# EAGLE board zx80_build039.routed (EAGLE 9.6.2), part 1 of 2
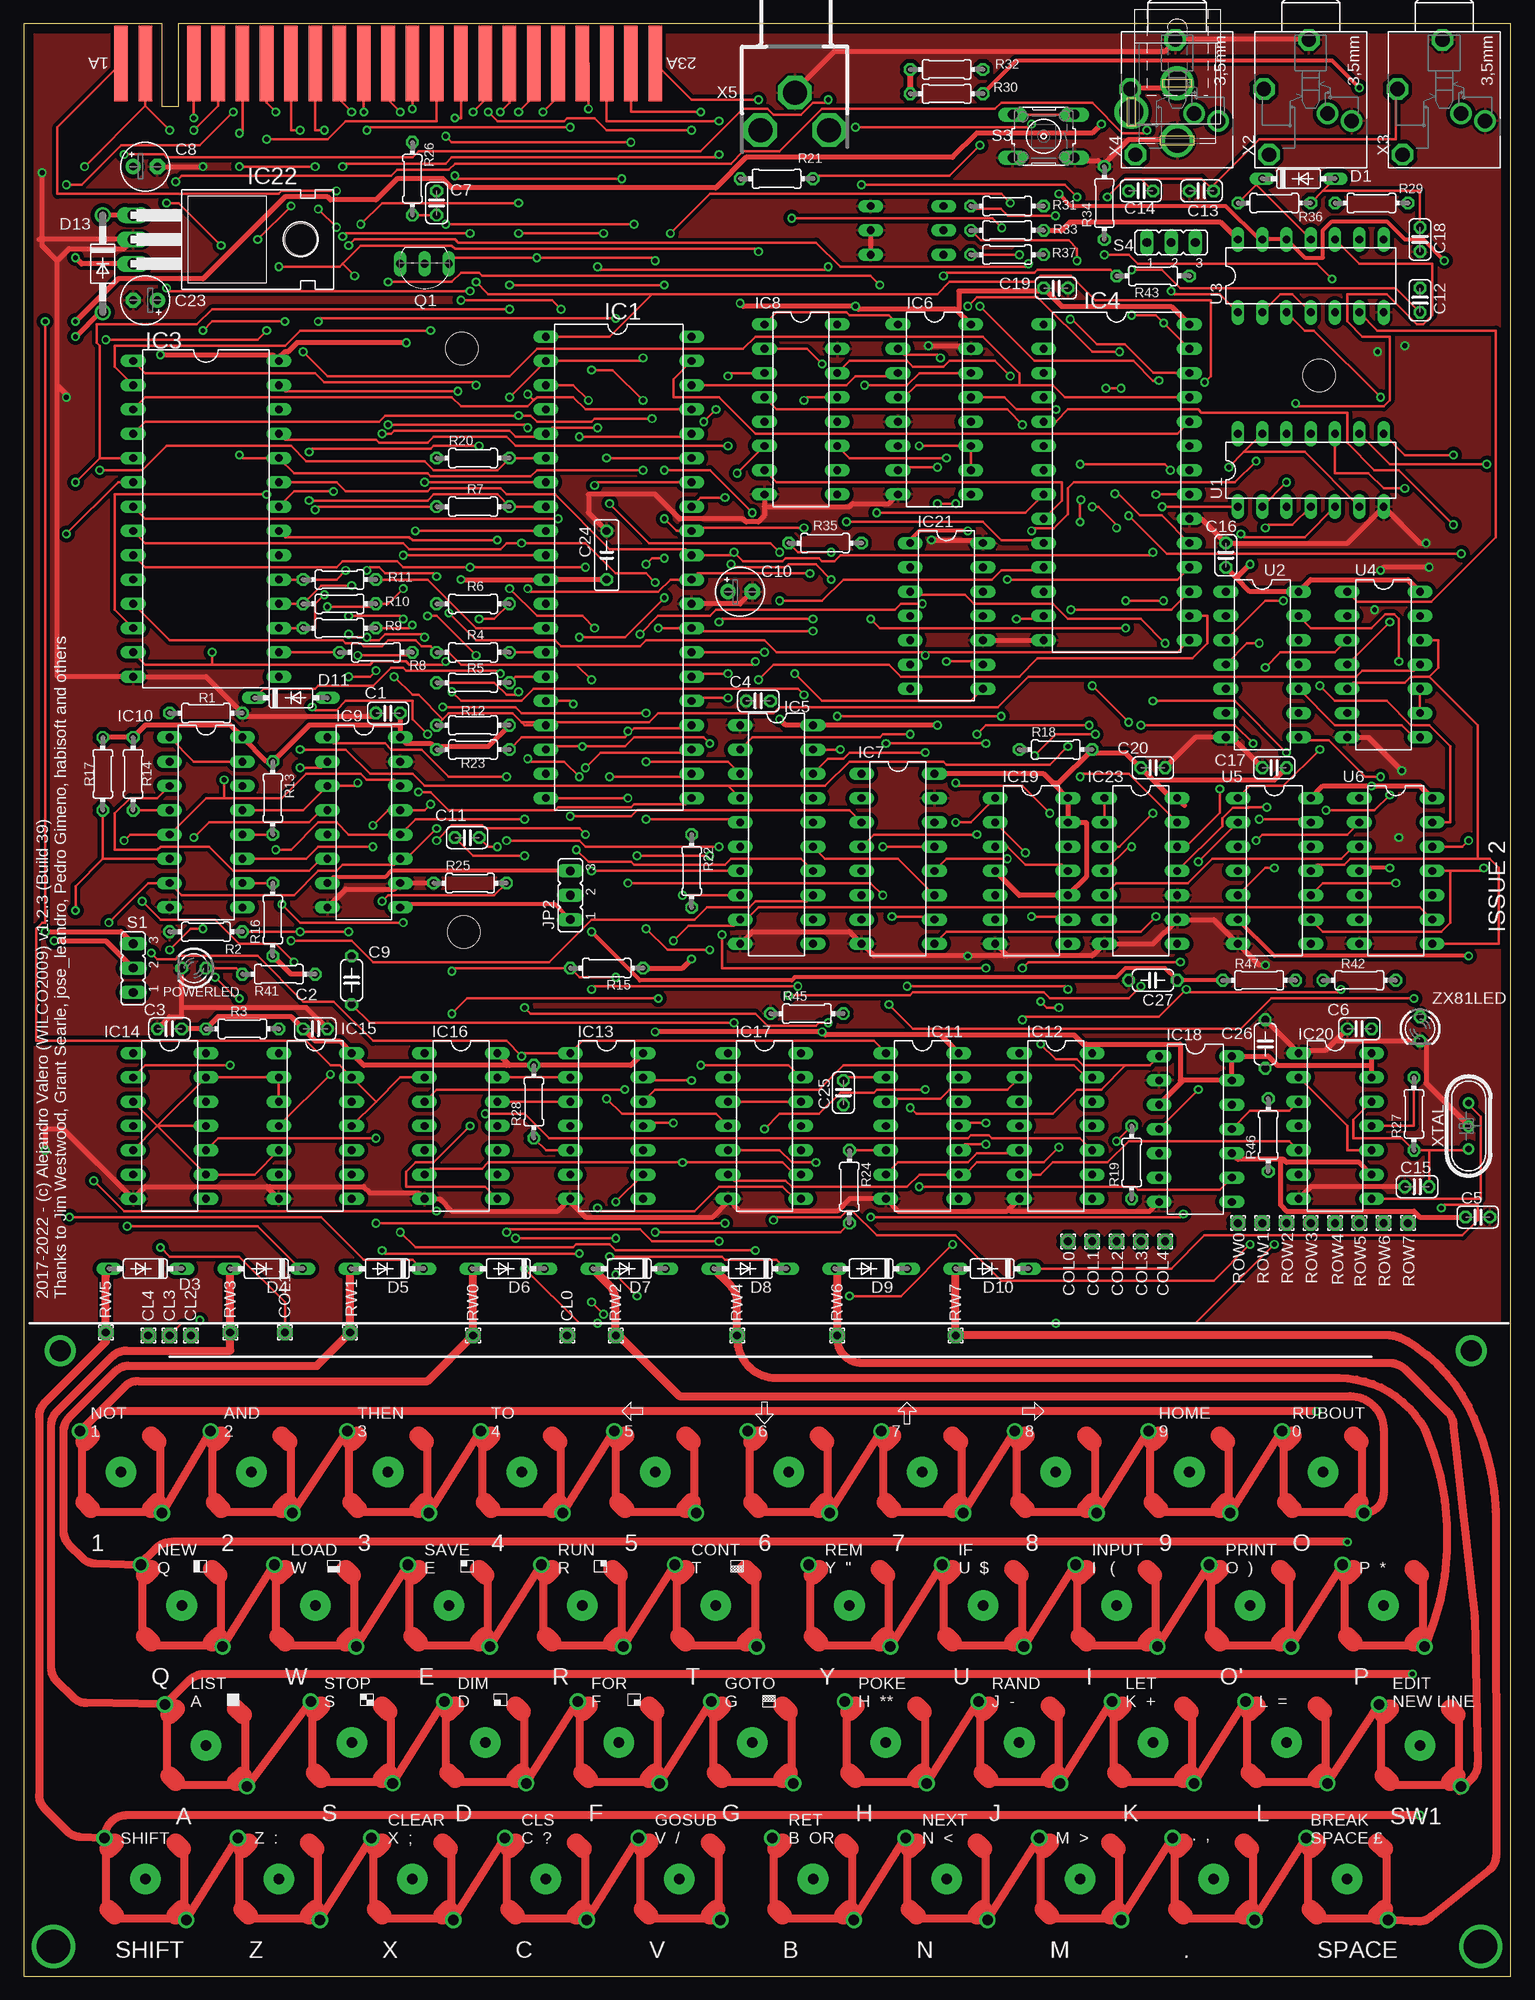
[diagram p3: board, top side]
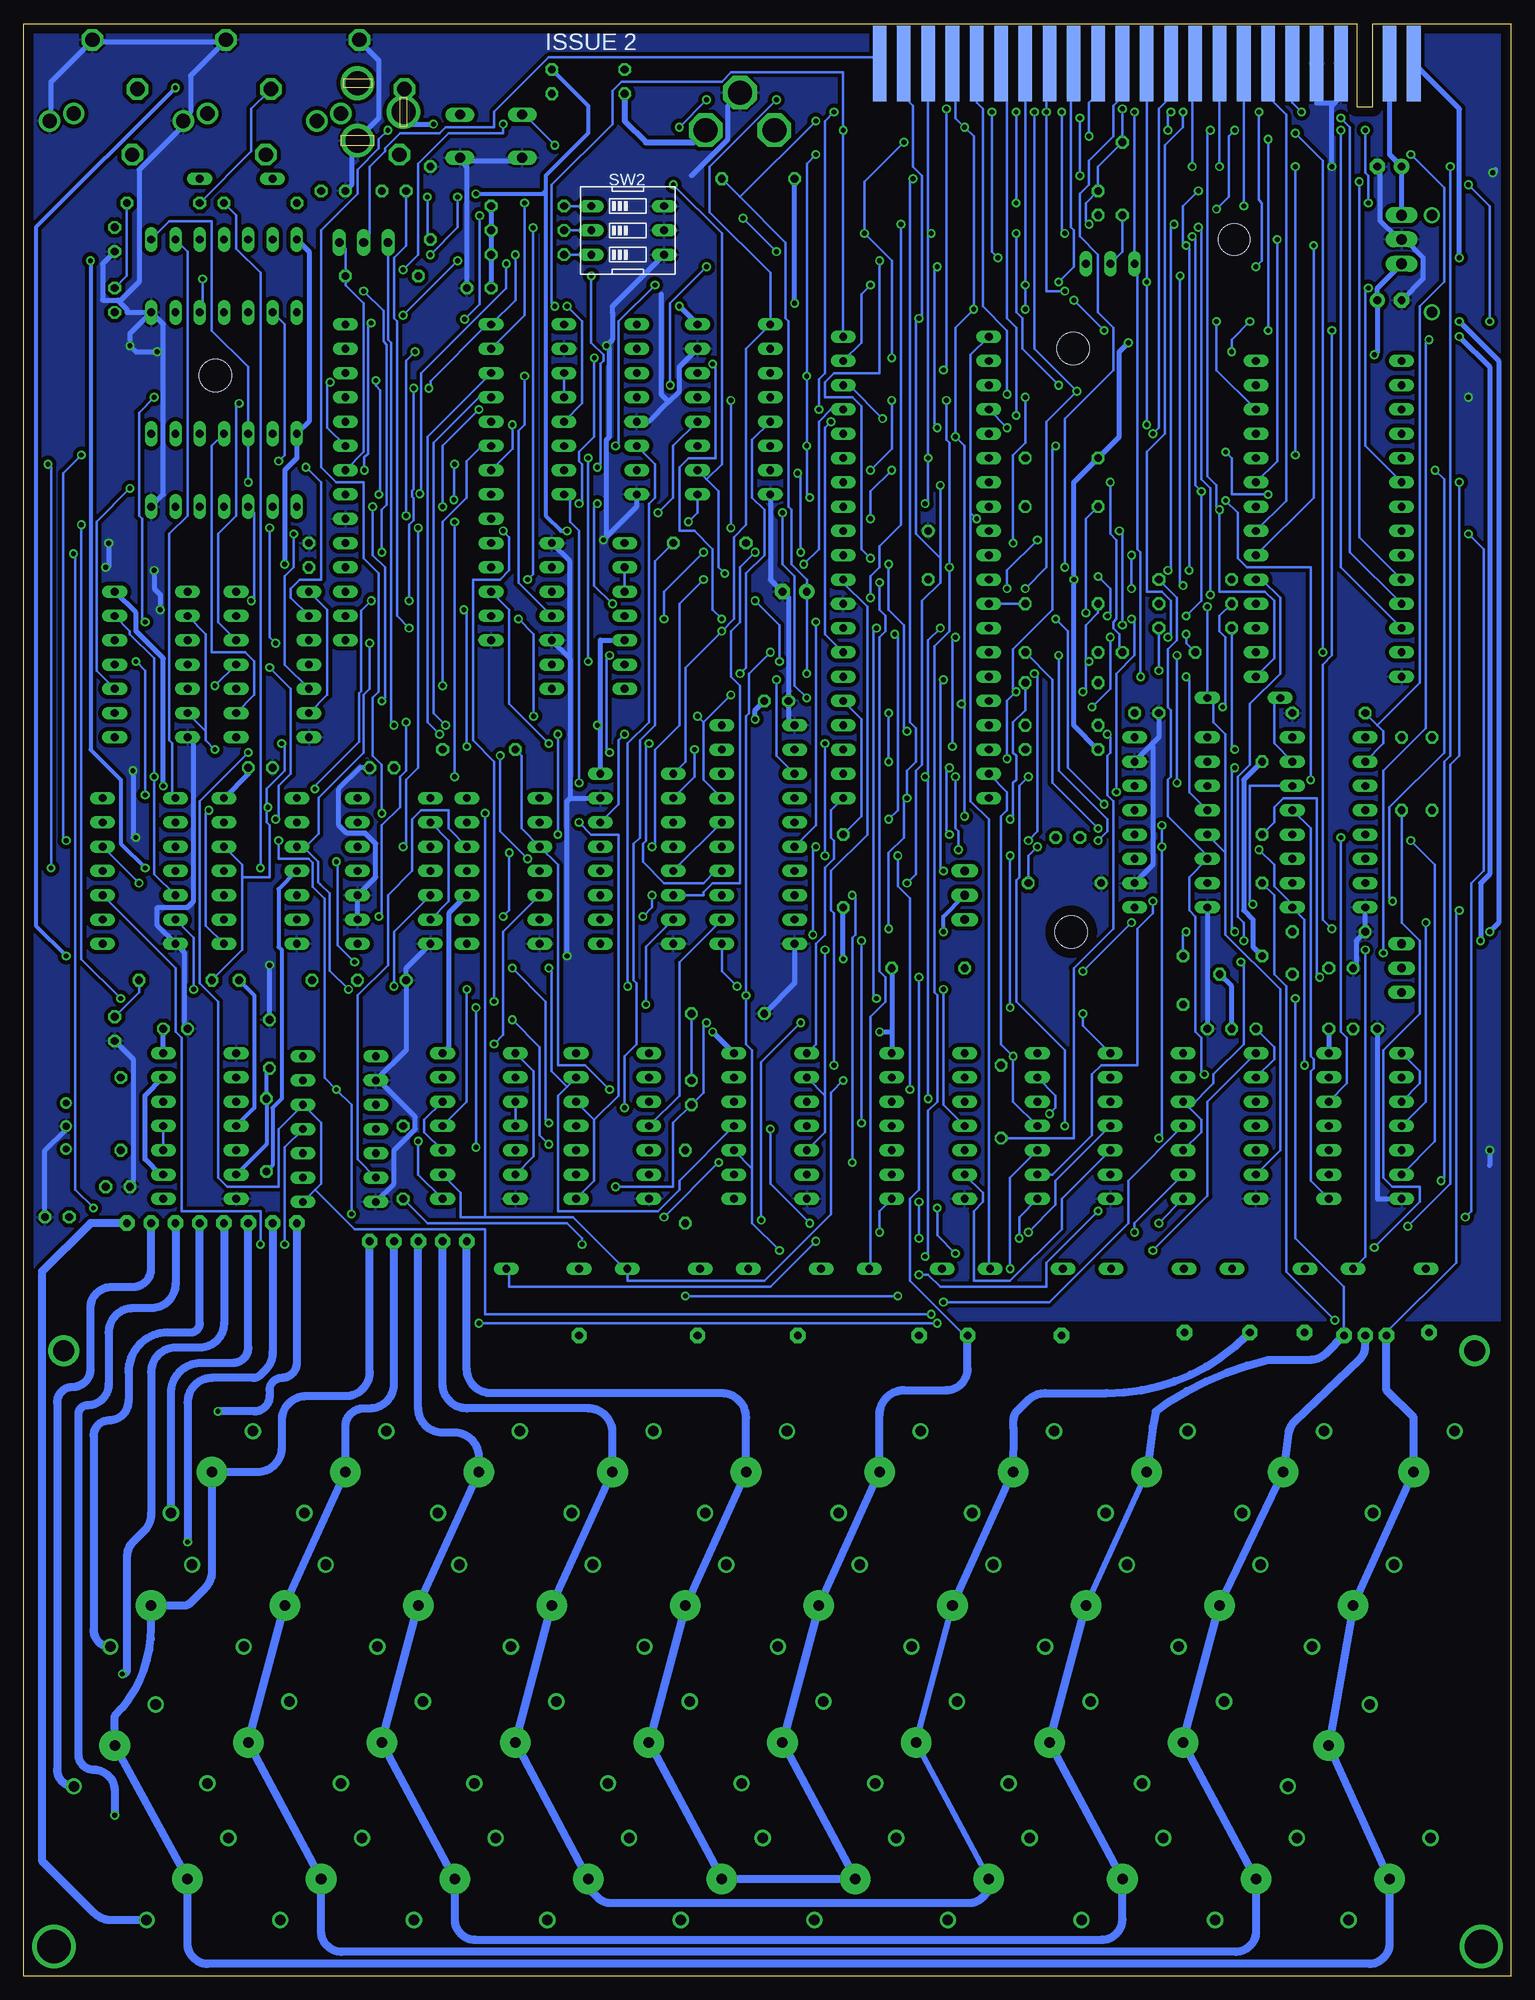
[diagram p4: board, bottom side, seen from below]

Size 155.56 x 204.15 mm. Coordinates in mm from the lower left corner, seen from the top.
Outline: 0,0 155.56,0 155.56,204.15 16.14,204.15 16.14,195.47 14.46,195.47 14.46,204.15 0,204.15 0,0
Copper layers (1*16): Top 0.035mm / dielectric 1.5mm / Bottom 0.035mm
Design rules "default *": minimum track width 10mil, minimum drill 20mil, track to track 8mil, track to pad 8mil, pad to pad 8mil, via to via 8mil, smd to smd 8mil, copper to edge 40mil, drill to drill 8mil, minimum pad ring 10mil, minimum via ring 8mil, stop-mask expansion 4mil, vias tented up to drill 0mil, thermal gap 10mil
Net classes: 1 VCC: width 0.5 mm
Holes 3.4 mm at 45.8,170.2 46,109.2 135.5,167.4
tRestrict: 22 lines
bRestrict: 22 lines

## Footprints (pad centres in the part's own frame; a part is rotated, then mirrored left to right if it is on the bottom)
TA_DK = drill 1.1 pad 3.2: 1 0,0 | drill 1.1 pad 1.7: 2@1 4.282,-4.282; 2@8 -4.282,4.282
EDGEPIN = smd 1.422 x 7.874: 1 0,0
C025-024X044 = drill 0.813 octagon: 1 -1.27,0; 2 1.27,0
E2,5-5 = drill 0.813 pad 1.6: + -1.27,0 | drill 0.813 pad 1.6 octagon: - 1.27,0
C050-024X044 = drill 0.813 octagon: 1 -2.54,0; 2 2.54,0
C050-025X075 = drill 0.813 octagon: 1 -2.54,0; 2 2.54,0
1,6/0,8 = drill 0.813 pad 1.6 octagon: 1 0,0
DO35-7 = drill 0.813 long: A 3.81,0; C -3.81,0
DO41-10 = drill 1.118: A 5.08,0; C -5.08,0
DIL40 = drill 0.813 long: 1 -24.13,-7.62; 2 -21.59,-7.62; 3 -19.05,-7.62; 4 -16.51,-7.62; 5 -13.97,-7.62; 6 -11.43,-7.62; 7 -8.89,-7.62; 8 -6.35,-7.62; 9 -3.81,-7.62; 10 -1.27,-7.62; 11 1.27,-7.62; 12 3.81,-7.62; 13 6.35,-7.62; 14 8.89,-7.62; 15 11.43,-7.62; 16 13.97,-7.62; 17 16.51,-7.62; 18 19.05,-7.62; 19 21.59,-7.62; 20 24.13,-7.62; 21 24.13,7.62; 22 21.59,7.62; 23 19.05,7.62; 24 16.51,7.62; 25 13.97,7.62; 26 11.43,7.62; 27 8.89,7.62; 28 6.35,7.62; 29 3.81,7.62; 30 1.27,7.62; 31 -1.27,7.62; 32 -3.81,7.62; 33 -6.35,7.62; 34 -8.89,7.62; 35 -11.43,7.62; 36 -13.97,7.62; 37 -16.51,7.62; 38 -19.05,7.62; 39 -21.59,7.62; 40 -24.13,7.62
DIL28-6 = drill 0.813 long: 1 -16.51,-7.62; 2 -13.97,-7.62; 3 -11.43,-7.62; 4 -8.89,-7.62; 5 -6.35,-7.62; 6 -3.81,-7.62; 7 -1.27,-7.62; 8 1.27,-7.62; 9 3.81,-7.62; 10 6.35,-7.62; 11 8.89,-7.62; 12 11.43,-7.62; 13 13.97,-7.62; 14 16.51,-7.62; 15 16.51,7.62; 16 13.97,7.62; 17 11.43,7.62; 18 8.89,7.62; 19 6.35,7.62; 20 3.81,7.62; 21 1.27,7.62; 22 -1.27,7.62; 23 -3.81,7.62; 24 -6.35,7.62; 25 -8.89,7.62; 26 -11.43,7.62; 27 -13.97,7.62; 28 -16.51,7.62
DIL28 = drill 0.813 long: 1 -16.51,-7.62; 2 -13.97,-7.62; 3 -11.43,-7.62; 4 -8.89,-7.62; 5 -6.35,-7.62; 6 -3.81,-7.62; 7 -1.27,-7.62; 8 1.27,-7.62; 9 3.81,-7.62; 10 6.35,-7.62; 11 8.89,-7.62; 12 11.43,-7.62; 13 13.97,-7.62; 14 16.51,-7.62; 15 16.51,7.62; 16 13.97,7.62; 17 11.43,7.62; 18 8.89,7.62; 19 6.35,7.62; 20 3.81,7.62; 21 1.27,7.62; 22 -1.27,7.62; 23 -3.81,7.62; 24 -6.35,7.62; 25 -8.89,7.62; 26 -11.43,7.62; 27 -13.97,7.62; 28 -16.51,7.62
DIL20 = drill 0.813 long: 1 -11.43,-3.81; 2 -8.89,-3.81; 3 -6.35,-3.81; 4 -3.81,-3.81; 5 -1.27,-3.81; 6 1.27,-3.81; 7 3.81,-3.81; 8 6.35,-3.81; 9 8.89,-3.81; 10 11.43,-3.81; 11 11.43,3.81; 12 8.89,3.81; 13 6.35,3.81; 14 3.81,3.81; 15 1.27,3.81; 16 -1.27,3.81; 17 -3.81,3.81; 18 -6.35,3.81; 19 -8.89,3.81; 20 -11.43,3.81
DIL16 = drill 0.813 long: 1 -8.89,-3.81; 2 -6.35,-3.81; 3 -3.81,-3.81; 4 -1.27,-3.81; 5 1.27,-3.81; 6 3.81,-3.81; 7 6.35,-3.81; 8 8.89,-3.81; 9 8.89,3.81; 10 6.35,3.81; 11 3.81,3.81; 12 1.27,3.81; 13 -1.27,3.81; 14 -3.81,3.81; 15 -6.35,3.81; 16 -8.89,3.81
DIL14 = drill 0.813 long: 1 -7.62,-3.81; 2 -5.08,-3.81; 3 -2.54,-3.81; 4 0,-3.81; 5 2.54,-3.81; 6 5.08,-3.81; 7 7.62,-3.81; 8 7.62,3.81; 9 5.08,3.81; 10 2.54,3.81; 11 0,3.81; 12 -2.54,3.81; 13 -5.08,3.81; 14 -7.62,3.81
TO220H = drill 1.118 long: 1 -2.54,-12.7; 2 0,-12.7; 3 2.54,-12.7 | hole 3.302: 0,4.826
SPC4077 = drill 2.5 pad 3.5: 1 -3,0; 2 0,-4.8; 3 3,0
JP2 = drill 0.914 long: 1 -2.54,0; 2 0,0; 3 2.54,0
LED3MM = drill 0.813 octagon: A -1.27,0; K 1.27,0
TO92-EBC = drill 0.813 long: B 0,-1.27; C -2.54,-1.27; E 2.54,-1.27
0204/7 = drill 0.813 octagon: 1 -3.81,0; 2 3.81,0
B3F-10XX = drill 1.016 long: 1 -3.251,2.261; 2 3.251,2.261; 3 -3.251,-2.261; 4 3.251,-2.261
EDG-03 = drill 0.813 long: 1 -2.54,-3.81; 2 0,-3.81; 3 2.54,-3.81; 4 2.54,3.81; 5 0,3.81; 6 -2.54,3.81
PG203J = drill 1.499 octagon: 1 -6.274,-0.203; 4 5.74,-4.369; 5 -1.118,-4.902 | drill 1.499: 2 2.21,4.267; 3 1.448,1.753
736880-49 = drill 2.5 pad 3.302 octagon: 1 -0.11,0; 2 3.81,3.595; 2@2 3.81,-3.595
HC49U = drill 0.7 pad 1.2: 1 -2.413,0; 2 -0.027,0; 3 2.413,0

## Placement (x,y rotation side)
1  TA_DK  [TA_DK]  10.16,52.7 0 top
1A  [EDGEPIN]  10.16,200.03 0 top
1B  [EDGEPIN]  10.16,200.03 0 bottom
2  TA_DK  [TA_DK]  23.81,52.7 0 top
2A  [EDGEPIN]  12.7,200.03 0 top
2B  [EDGEPIN]  12.7,200.03 0 bottom
3  TA_DK  [TA_DK]  38.1,52.7 0 top
4  TA_DK  [TA_DK]  52.07,52.7 0 top
4A  [EDGEPIN]  17.78,200.03 0 top
4B  [EDGEPIN]  17.78,200.03 0 bottom
5  TA_DK  [TA_DK]  66.04,52.7 0 top
5A  [EDGEPIN]  20.32,200.03 0 top
5B  [EDGEPIN]  20.32,200.03 0 bottom
6  TA_DK  [TA_DK]  80.01,52.7 0 top
6A  [EDGEPIN]  22.86,200.03 0 top
6B  [EDGEPIN]  22.86,200.03 0 bottom
7  TA_DK  [TA_DK]  93.98,52.7 0 top
7A  [EDGEPIN]  25.4,200.03 0 top
7B  [EDGEPIN]  25.4,200.03 0 bottom
8  TA_DK  [TA_DK]  107.95,52.7 0 top
8A  [EDGEPIN]  27.94,200.03 0 top
8B  [EDGEPIN]  27.94,200.03 0 bottom
9  TA_DK  [TA_DK]  121.92,52.7 0 top
9A  [EDGEPIN]  30.48,200.03 0 top
9B  [EDGEPIN]  30.48,200.03 0 bottom
10A  [EDGEPIN]  33.02,200.03 0 top
10B  [EDGEPIN]  33.02,200.03 0 bottom
11A  [EDGEPIN]  35.56,200.03 0 top
11B  [EDGEPIN]  35.56,200.03 0 bottom
12A  [EDGEPIN]  38.1,200.03 0 top
12B  [EDGEPIN]  38.1,200.03 0 bottom
13A  [EDGEPIN]  40.64,200.03 0 top
13B  [EDGEPIN]  40.64,200.03 0 bottom
14A  [EDGEPIN]  43.18,200.03 0 top
14B  [EDGEPIN]  43.18,200.03 0 bottom
15A  [EDGEPIN]  45.72,200.03 0 top
15B  [EDGEPIN]  45.72,200.03 0 bottom
16A  [EDGEPIN]  48.26,200.03 0 top
16B  [EDGEPIN]  48.26,200.03 0 bottom
17A  [EDGEPIN]  50.8,200.03 0 top
17B  [EDGEPIN]  50.8,200.03 0 bottom
18A  [EDGEPIN]  53.34,200.03 0 top
18B  [EDGEPIN]  53.34,200.03 0 bottom
19A  [EDGEPIN]  55.88,200.03 0 top
19B  [EDGEPIN]  55.88,200.03 0 bottom
20A  [EDGEPIN]  58.42,200.03 0 top
20B  [EDGEPIN]  58.42,200.03 0 bottom
21A  [EDGEPIN]  60.96,200.03 0 top
21B  [EDGEPIN]  60.96,200.03 0 bottom
22A  [EDGEPIN]  63.5,200.03 0 top
22B  [EDGEPIN]  63.5,200.03 0 bottom
23A  [EDGEPIN]  66.04,200.03 0 top
23B  [EDGEPIN]  66.04,200.03 0 bottom
.  TA_DK  [TA_DK]  124.46,10.16 0 top
A  TA_DK  [TA_DK]  19.05,24.13 0 top
B  TA_DK  [TA_DK]  82.55,10.16 0 top
C  TA_DK  [TA_DK]  54.61,10.16 0 top
C1  47nF  [C025-024X044]  38.1,132.08 180 top
C2  47nF  [C025-024X044]  30.48,99.06 0 top
C3  47nF  [C025-024X044]  15.24,99.06 180 top
C4  47nF  [C025-024X044]  76.83,133.35 180 top
C5  47nF  [C025-024X044]  152.08,79.38 0 top
C6  100nF  [C025-024X044]  139.7,99.06 180 top
C7  100pF  [C025-024X044]  43.18,185.42 90 top
C8  22uF  [E2,5-5]  12.7,189.23 0 top
C9  47pF  [C050-024X044]  34.29,104.14 270 top
C10  1uF  [E2,5-5]  74.93,144.78 0 top
C11  47pF  [C025-024X044]  46.35,119.06 0 top
C12  100nF  [C025-024X044]  146.05,175.26 270 top
C13  47nF  [C025-024X044]  123.19,186.69 180 top
C14  1nF  [C025-024X044]  116.84,186.69 0 top
C15  220pF  [C025-024X044]  145.73,82.55 0 top
C16  47nF  [C025-024X044]  125.73,148.59 90 top
C17  47nF  [C025-024X044]  130.81,126.36 180 top
C18  10nF  [C025-024X044]  146.05,181.61 270 top
C19  47nF  [C025-024X044]  107.95,176.53 0 top
C20  47nF  [C025-024X044]  118.11,126.36 0 top
C23  100uF  [E2,5-5]  12.7,175.26 180 top
C24  100nF  [C050-025X075]  60.96,148.59 90 top
C25  100pF  [C025-024X044]  85.72,92.39 90 top
C26  100pF  [C050-024X044]  129.86,97.47 90 top
C27  470pf  [C050-024X044]  118.11,104.14 180 top
CL0  [1,6/0,8]  56.83,66.99 0 top
CL2  [1,6/0,8]  17.46,66.99 0 top
CL3  [1,6/0,8]  15.24,66.99 0 top
CL4  [1,6/0,8]  13.02,66.99 0 top
COL0  [1,6/0,8]  109.22,76.83 0 top
COL1  [1,6/0,8]  111.76,76.83 0 top
COL1'  [1,6/0,8]  27.3,67.31 0 top
COL2  [1,6/0,8]  114.3,76.83 0 top
COL3  [1,6/0,8]  116.84,76.83 0 top
COL4  [1,6/0,8]  119.38,76.83 0 top
D  TA_DK  [TA_DK]  48.26,24.45 0 top
D1  1N4148DO35-7  [DO35-7]  133.35,187.96 0 top
D3  1N4148DO35-7  [DO35-7]  12.7,73.98 180 top
D4  1N4148DO35-7  [DO35-7]  25.35,73.98 180 top
D5  1N4148DO35-7  [DO35-7]  38.01,73.98 180 top
D6  1N4148DO35-7  [DO35-7]  50.66,73.98 180 top
D7  1N4148DO35-7  [DO35-7]  63.32,73.98 180 top
D8  1N4148DO35-7  [DO35-7]  75.97,73.98 180 top
D9  1N4148DO35-7  [DO35-7]  88.63,73.98 180 top
D10  1N4148DO35-7  [DO35-7]  101.28,73.98 180 top
D11  NTSC ONLY  [DO35-7]  27.94,133.67 0 top
D13  1N4007  [DO41-10]  8.26,179.07 270 top
E  TA_DK  [TA_DK]  44.45,38.73 0 top
F  TA_DK  [TA_DK]  62.23,24.45 0 top
G  TA_DK  [TA_DK]  76.2,24.45 0 top
H  TA_DK  [TA_DK]  90.17,24.45 0 top
I  TA_DK  [TA_DK]  114.3,38.73 0 top
IC1  Z80A  [DIL40]  62.23,147.32 270 top
IC3  CY62256LL-PC  [DIL28-6]  19.05,152.4 270 top
IC4  W27C512  [DIL28]  114.3,156.21 270 top
IC5  74S373N  [DIL20]  78.74,119.38 270 top
IC6  74157N  [DIL16]  95.25,163.83 270 top
IC7  74157N  [DIL16]  91.44,116.84 270 top
IC8  74157N  [DIL16]  81.28,163.83 270 top
IC9  74165N  [DIL16]  35.56,120.65 270 top
IC10  74LS365N  [DIL16]  19.05,120.65 270 top
IC11  74LS00N  [DIL14]  93.98,88.9 270 top
IC12  74LS00N  [DIL14]  107.95,88.9 270 top
IC13  74LS04N  [DIL14]  60.96,88.9 270 top
IC14  74LS05N  [DIL14]  15.24,88.9 270 top
IC15  74LS05N  [DIL14]  30.48,88.9 270 top
IC16  74LS10N  [DIL14]  45.72,88.9 270 top
IC17  74LS32N  [DIL14]  77.47,88.9 270 top
IC18  74LS74N  [DIL14]  122.56,88.58 270 top
IC19  74LS74N  [DIL14]  105.41,115.57 270 top
IC20  74LS86N  [DIL14]  137.16,88.9 270 top
IC21  74LS93N  [DIL14]  96.52,142.24 270 top
IC22  7805T  [TO220H]  24.13,181.61 270 top
IC23  74LS00N  [DIL14]  116.84,115.57 270 top
J  TA_DK  [TA_DK]  104.14,24.45 0 top
J1  [SPC4077]  120.65,194.94 270 top
JP2  VIDEO_MODE  [JP2]  57.15,113.03 90 top
K  TA_DK  [TA_DK]  118.11,24.45 0 top
L  TA_DK  [TA_DK]  132.08,24.45 0 top
M  TA_DK  [TA_DK]  110.49,10.16 0 top
N  TA_DK  [TA_DK]  96.52,10.16 0 top
O  TA_DK  [TA_DK]  135.89,52.7 0 top
O'  TA_DK  [TA_DK]  128.27,38.73 0 top
P  TA_DK  [TA_DK]  142.24,38.73 0 top
POWERLED  RED  [LED3MM]  17.78,105.41 180 top
Q  TA_DK  [TA_DK]  16.51,38.73 0 top
Q1  BC548  [TO92-EBC]  41.91,177.8 180 top
R  TA_DK  [TA_DK]  58.42,38.73 0 top
R1  10K  [0204/7]  19.05,132.08 180 top
R2  330  [0204/7]  19.05,109.22 0 top
R3  1K  [0204/7]  22.86,99.06 0 top
R4  1K  [0204/7]  46.99,138.43 0 top
R5  1K  [0204/7]  46.99,135.25 0 top
R6  1K  [0204/7]  46.99,143.51 0 top
R7  1K  [0204/7]  46.99,153.67 0 top
R8  1K  [0204/7]  36.83,138.43 0 top
R9  1K  [0204/7]  33.02,140.97 0 top
R10  1K  [0204/7]  33.02,143.51 0 top
R11  1K  [0204/7]  33.02,146.05 0 top
R12  1K  [0204/7]  46.99,130.81 0 top
R13  47K  [0204/7]  26.04,123.19 270 top
R14  47K  [0204/7]  11.43,125.73 270 top
R15  47K  [0204/7]  60.96,105.41 180 top
R16  47K  [0204/7]  26.04,110.49 90 top
R17  47K  [0204/7]  8.26,125.73 270 top
R18  1K  [0204/7]  107.95,128.27 180 top
R19  2K2  [0204/7]  115.89,85.09 90 top
R20  330  [0204/7]  46.99,158.75 180 top
R21  220K  [0204/7]  78.74,187.96 180 top
R22  1K  [0204/7]  69.85,115.57 270 top
R23  1K  [0204/7]  46.99,128.27 180 top
R24  1K  [0204/7]  86.36,82.55 270 top
R25  470  [0204/7]  46.67,114.3 0 top
R26  10K  [0204/7]  40.64,187.96 270 top
R27  1K  [0204/7]  145.41,90.17 90 top
R28  47K  [0204/7]  53.34,91.44 90 top
R29  180  [0204/7]  140.97,185.42 0 top
R30  900  [0204/7]  96.52,196.85 180 top
R31  4k7  [0204/7]  102.87,185.1 0 top
R32  390  [0204/7]  96.52,199.39 180 top
R33  4k7  [0204/7]  102.87,182.56 0 top
R34  1K  [0204/7]  113.03,185.42 90 top
R35  100K  [0204/7]  83.82,149.86 0 top
R36  2K7  [0204/7]  130.81,185.42 180 top
R37  4k7  [0204/7]  102.87,180.02 0 top
R41  680  [0204/7]  26.67,104.78 180 top
R42  680  [0204/7]  139.7,104.14 180 top
R43  680  [0204/7]  118.11,177.8 180 top
R45  330  [0204/7]  81.92,100.65 0 top
R46  680-6K8  [0204/7]  130.18,87.95 90 top
R47  0  [0204/7]  129.22,104.14 180 top
ROW0  [1,6/0,8]  127,78.74 90 top
ROW1  [1,6/0,8]  129.54,78.74 90 top
ROW2  [1,6/0,8]  132.08,78.74 90 top
ROW3  [1,6/0,8]  134.62,78.74 90 top
ROW4  [1,6/0,8]  137.16,78.74 90 top
ROW5  [1,6/0,8]  139.7,78.74 90 top
ROW6  [1,6/0,8]  142.24,78.74 90 top
ROW7  [1,6/0,8]  144.78,78.74 90 top
RW0  [1,6/0,8]  46.99,66.99 0 top
RW1  [1,6/0,8]  34.12,67.31 0 top
RW2  [1,6/0,8]  61.91,66.99 0 top
RW3  [1,6/0,8]  21.59,67.31 0 top
RW4  [1,6/0,8]  74.61,66.99 0 top
RW5  [1,6/0,8]  8.57,67.31 0 top
RW6  [1,6/0,8]  85.09,66.99 0 top
RW7  [1,6/0,8]  97.47,66.99 0 top
S  TA_DK  [TA_DK]  34.29,24.45 0 top
S1  [JP2]  11.43,105.41 90 top
S3  RESET  [B3F-10XX]  106.68,192.41 180 top
S4  PIN23A  [JP2]  120.02,181.29 0 top
SHIFT  TA_DK  [TA_DK]  12.7,10.16 0 top
SPACE  TA_DK  [TA_DK]  138.43,10.16 0 top
SW1  TA_DK  [TA_DK]  146.05,24.13 0 top
SW2  ROM SEL  [EDG-03]  92.39,182.56 270 bottom
T  TA_DK  [TA_DK]  72.39,38.73 0 top
U  TA_DK  [TA_DK]  100.33,38.73 0 top
U1  74HC393N  [DIL14]  134.62,157.48 0 top
U2  74AC11N  [DIL14]  129.54,137.16 270 top
U3  74LS32N  [DIL14]  134.62,177.8 0 top
U4  74LS00N  [DIL14]  142.24,137.16 270 top
U5  74LS08N  [DIL14]  130.81,115.57 270 top
U6  74LS02N  [DIL14]  143.51,115.57 270 top
V  TA_DK  [TA_DK]  68.58,10.16 0 top
W  TA_DK  [TA_DK]  30.48,38.73 0 top
X  TA_DK  [TA_DK]  40.64,10.16 0 top
X2  EAR  [PG203J]  134.62,196.22 270 top
X3  MIC  [PG203J]  148.59,196.22 270 top
X4  POWER  [PG203J]  120.65,196.22 270 top
X5  736880-49  [736880-49]  80.64,196.85 270 top
XTAL  6.5MHz  [HC49U]  151.13,88.9 90 top
Y  TA_DK  [TA_DK]  86.36,38.73 0 top
Z  TA_DK  [TA_DK]  26.67,10.16 0 top
ZX81LED  YELLOW  [LED3MM]  146.05,99.06 270 top

## Tracks (layer width: path | path; a pad name or v marks a point on that pad's centre or on a via)
2CLK  (via drill 0.51)
  Top 0.254: IC18.11 128.27,90.49 132.4,90.49 IC20.3 | C9.2 36.2,99.69 v74.3,99.69 | v78.42,79.06 78.74,79.38 85.41,79.38 86.04,80.01 86.68,80.01 89.22,77.47 97.47,77.47 102.23,72.71 124.46,72.71 v128.27,76.52
  Bottom 0.254: v74.3,99.69 78.42,95.57 v78.42,79.06 | v128.27,76.52 128.27,86.68 IC18.11
9V
  Top 0.5: IC22.1 D13.C
  Bottom 0.5: IC22.1 C8.+ 12.7,190.5 2B.1
/BUSAK  (via drill 0.51)
  Top 0.254: IC1.23 69.53,127.95 60.33,127.95 v58.74,126.36 | v58.74,119.38 58.1,120.02 48.26,120.02 47.94,120.33 44.77,120.33 v43.18,118.75 | v47.31,138.11 43.18,142.24 v42.23,142.24 | v43.18,146.37 42.86,146.69 37.78,146.69 37.15,147.32 36.2,147.32 v35.88,147 | v35.24,183.2 37.47,185.42 v51.75,185.42 | v51.75,194.94 53.34,196.53 18A.1
  Bottom 0.254: v58.74,126.36 59.05,126.05 59.05,119.7 v58.74,119.38 | v43.18,118.75 42.23,119.7 42.23,120.97 47.31,126.05 v47.31,138.11 | v42.23,142.24 41.91,142.56 41.91,145.1 v43.18,146.37 | v35.88,147 35.56,147.32 35.56,182.88 v35.24,183.2 | v51.75,194.94 v51.75,185.42
/BUSRQ  (via drill 0.51)
  Top 0.254: IC1.25 70.17,133.67 v73.66,133.67 | v76.2,153.03 71.75,157.48 v66.99,157.48 | v64.77,164.78 61.59,167.96 v59.37,167.96 | v59.05,195.26 59.05,200.03 20A.1
  Bottom 0.254: R22.1 67.94,121.28 67.94,131.44 IC1.25 | v73.66,133.67 74.93,134.94 74.93,146.37 76.2,147.64 v76.2,153.03 | v66.99,157.48 64.77,159.7 v64.77,164.78 | v59.37,167.96 59.05,168.28 v59.05,195.26
/CLOCK  (via drill 0.51)
  Top 0.254: 36.83,91.44 39.37,93.98 IC16.2 | 36.83,91.44 IC15.11 | 36.83,91.44 IC15.13 33.02,95.25 32.07,95.25 29.53,97.79 1.27,97.79 1.27,109.54 1.91,110.17 2.22,110.17 v2.22,173.04 | v119.06,153.67 U1.1 | v118.11,133.35 126.68,133.35 v132.08,127.95 | v60.64,69.22 v59.37,70.48 | v21.91,194.94 18.41,191.45 10.16,191.45 6.03,187.32 v4.45,187.32
  Bottom 0.254: 125.09,82.23 124.46,82.87 124.46,89.22 IC18.12 128.91,88.58 128.91,82.55 134.3,82.55 135.25,83.5 135.25,101.92 137.16,103.82 137.16,122.87 v132.08,127.95 | 125.09,82.23 IC18.8 | v119.06,153.67 119.06,148.59 117.79,147.32 117.79,133.67 v118.11,133.35 | IC15.11 40.01,83.19 40.01,78.74 48.26,70.48 v59.37,70.48 | v60.64,69.22 107.31,69.22 107.31,78.11 120.97,78.11 125.09,82.23 | 6B.1 22.86,195.9 v21.91,194.94 | v4.45,187.32 2.22,185.1 v2.22,173.04
/HALT  (via drill 0.51)
  Top 0.254: 13A.1 v40.64,195.26 | IC16.3 43.18,92.71 v62.87,92.71 | v71.75,117.16 v64.14,117.16 | v71.75,128.91 71.12,129.54 63.82,129.54 62.87,128.59 v58.42,128.59 54.93,128.59 IC1.18 | v63.82,183.2 v44.13,183.2 | v66.99,144.15 62.87,140.02 v58.1,140.02
  Bottom 0.254: v40.64,195.26 R26.1 43.18,189.23 C7.2 44.45,185.42 44.45,183.51 v44.13,183.2 | v62.87,92.71 62.87,112.71 64.14,113.98 v64.14,117.16 | v71.75,128.91 v71.75,117.16 | v63.82,183.2 63.82,151.76 66.04,149.54 66.04,147.32 66.99,146.37 v66.99,144.15 | v58.1,140.02 58.42,139.7 v58.42,128.59
/IORQ  (via drill 0.51)
  Top 0.254: v122.87,92.71 IC18.4 | v128.91,118.75 129.54,119.38 138.43,119.38 U6.2 | v63.18,123.19 IC1.20 | v65.09,109.54 67.31,107.31 v71.75,107.31 | 15A.1 45.72,194.31 v45.09,194.31 | v45.09,188.28 45.4,187.96 v62.55,187.96 | v82.87,85.09 80.33,85.09 79.06,86.36 IC17.5 | v121.28,79.69 120.97,79.38 v88.58,79.38
  Bottom 0.254: v128.91,118.75 128.91,116.84 125.76,116.84 125.34,116.42 125.34,113.93 124.1,112.68 124.1,93.93 v122.87,92.71 121.28,91.12 v121.28,79.69 | IC17.5 71.75,88.27 71.75,92.08 | IC17.2 71.75,92.08 | v65.09,109.54 65.09,117.47 63.5,119.06 63.5,122.87 v63.18,123.19 63.18,126.05 62.23,127 62.23,130.49 62.87,131.13 62.87,187.64 v62.55,187.96 | 71.75,92.08 v71.75,107.31 | v45.09,188.28 v45.09,194.31 | v82.87,85.09 v88.58,79.38
/IORQ+/WR  (via drill 0.51)
  Top 0.254: U3.2 131.44,175.9 132.72,175.9 U3.4 | IC17.6 74.3,83.19 79.69,83.19 80.33,82.55 92.39,82.55 93.66,83.82 IC11.9 98.42,83.82 99.69,85.09 106.68,85.09 v108.27,86.68 | v128.91,158.43 126.68,156.21 109.86,156.21 109.22,155.57 109.22,152.88 107.75,151.41 105.69,151.41 v105.41,151.13 | v106.36,101.92 107,101.28 v108.27,101.28
  Bottom 0.254: U3.2 128.27,172.72 128.27,159.07 v128.91,158.43 | v105.41,151.13 104.78,150.5 104.78,147 105.73,146.05 108.58,146.05 108.58,129.22 106.36,127 v106.36,101.92 | v108.27,86.68 v108.27,101.28
/KBD  (via drill 0.51)
  Top 0.254: IC10.1 17.78,127 IC10.15 | D11.C 25.08,134.62 30.48,134.62 30.8,134.94 36.51,134.94 38.42,136.84 39.69,136.84 40.01,136.53 49.53,136.53 v49.85,136.21 | v50.48,118.75 58.1,118.75 58.74,118.11 v72.71,118.11 | v73.03,108.9 73.03,105.41 v100.65,105.41
  Bottom 0.254: D11.C 24.77,133.03 24.77,128.91 IC10.15 | IC17.11 87,83.19 87,82.23 89.22,80.01 99.69,80.01 99.69,92.08 98.74,93.03 | IC11.13 98.74,93.03 | v49.85,136.21 49.53,135.89 49.53,119.7 v50.48,118.75 | v72.71,118.11 73.03,117.79 v73.03,108.9 | v100.65,105.41 100.33,105.09 100.33,94.61 98.74,93.03
/M1  (via drill 0.51)
  Top 0.254: IC23.5 114.3,114.3 121.78,114.3 124.32,116.84 137.79,116.84 139.06,118.11 U6.3 | v39.37,77.79 40.96,76.2 57.47,76.2 57.78,76.52 61.28,76.52 61.91,75.88 v76.52,75.88 | v77.47,138.43 IC1.27 | 22A.1 63.5,194.94 v70.8,194.94 | v71.12,162.56 v72.39,163.83 | v116.84,103.5 115.57,102.23 107.31,102.23 106.68,102.87 93.03,102.87 92.71,102.55 v80.01,102.55
  Bottom 0.254: IC15.9 39.37,78.74 v39.37,77.79 | v76.52,75.88 79.38,78.74 79.38,84.45 | IC17.10 79.38,84.45 | v77.47,138.43 79.69,136.21 79.69,132.08 80.01,131.76 v80.01,102.55 80.01,97.47 79.38,96.84 79.38,84.45 | v70.8,194.94 71.75,193.99 71.75,167.64 72.39,167 v72.39,163.83 | v71.12,162.56 71.75,161.93 71.75,140.34 IC1.27 | IC23.5 116.84,109.22 v116.84,103.5
/MREQ  (via drill 0.51)
  Top 0.254: IC11.1 88.9,97.79 58.42,97.79 IC13.1 52.39,96.52 v52.07,96.2 50.48,97.79 36.51,97.79 32.38,101.92 29.21,101.92 24.45,106.68 16.19,106.68 15.88,106.36 13.97,106.36 v13.34,107 | 14A.1 43.18,193.99 33.66,193.99 31.75,192.09 v25.4,192.09 | v25.4,172.09 24.45,171.13 v8.57,171.13
  Bottom 0.254: IC16.11 52.07,91.44 v52.07,96.2 53.34,97.47 53.34,121.28 52.7,121.92 52.7,123.83 IC1.19 | v25.4,172.09 v25.4,192.09 | v8.57,171.13 8.89,170.81 8.89,130.49 13.34,126.05 v13.34,107
/NMI  (via drill 0.51)
  Top 0.254: v39.37,194.94 38.1,196.22 12A.1 | 43.81,131.44 44.45,132.08 51.12,132.08 52.07,131.13 | 43.81,131.44 R12.1 | 52.07,131.13 52.39,130.81 IC1.17 | U4.11 145.41,136.53 140.02,136.53 139.38,135.89 105.09,135.89 101.92,132.72 79.06,132.72 78.42,132.08 66.36,132.08 65.41,131.13 52.07,131.13 | v38.73,135.89 40.64,133.99 41.27,133.99 43.81,131.44
  Bottom 0.254: v39.37,194.94 Q1.E 39.05,178.75 39.05,149.22 38.73,148.91 v38.73,135.89
/RAMCS  (via drill 0.51)
  Top 0.254: v20.64,180.97 16.19,185.42 v14.92,185.42 | 12.7,195.58 v15.24,193.04 | 2A.1 12.7,195.58 | v97.16,76.52 91.76,71.12 v86.36,71.12 | v61.91,73.34 v64.14,71.12 | v43.18,80.01 10.48,80.01 v7.3,83.19 | 12.7,195.58 v6.35,189.23
  Bottom 0.254: IC3.20 20.64,154.62 v20.64,180.97 | v14.92,185.42 14.92,188.28 15.24,188.59 v15.24,193.04 | v97.16,76.52 97.16,77.15 98.74,78.74 113.35,78.74 R19.1 | v64.14,71.12 v86.36,71.12 | v61.91,73.34 60.96,73.34 59.69,72.07 48.58,72.07 48.58,74.61 v43.18,80.01 | v7.3,83.19 6.99,83.5 6.99,127 6.35,127.64 v6.35,189.23
/RD  (via drill 0.51)
  Top 0.254: IC3.22 28.26,155.26 v32.38,155.26 | v33.34,181.93 33.66,182.25 v46.67,182.25 | v46.99,194.94 48.26,196.22 16A.1 | IC1.21 69.22,122.56 63.82,122.56 63.5,122.24 55.88,122.24 55.56,121.92 44.45,121.92 42.55,123.83 v41.27,123.83 | v39.69,141.92 39.37,142.24 v33.97,142.24
  Bottom 0.254: IC17.1 72.71,97.47 72.71,107.95 71.75,108.9 71.75,115.89 70.8,116.84 70.8,118.75 71.12,119.06 71.12,121.92 IC1.21 | v33.34,181.93 33.02,181.61 33.02,155.89 v32.38,155.26 32.38,143.83 v33.97,142.24 | v46.67,182.25 46.99,182.56 v46.99,194.94 | v41.27,123.83 41.27,136.21 39.37,138.11 39.37,141.6 v39.69,141.92
/RESET  (via drill 0.51)
  Top 0.254: S3.4 103.5,194.63 109.86,194.63 S3.3 | IC1.26 70.17,136.21 v73.66,136.21 | v100.01,191.45 96.84,188.28 82.87,188.28 R21.1 | 21A.1 60.96,193.99 v72.71,193.99
  Bottom 0.254: v73.66,136.21 C10.+ 73.66,146.05 75.25,147.64 75.25,153.35 75.56,153.67 75.56,173.04 75.88,173.35 75.88,181.29 80.64,186.06 | 80.64,186.06 R21.1 | v100.01,191.45 103.19,194.63 S3.4 | 80.64,186.06 v72.71,193.99
/RFSH  (via drill 0.51)
  Top 0.254: v44.77,100.65 46.35,102.23 v66.36,102.23 | v66.36,140.97 IC1.28 70.17,140.65 v82.55,140.65 | IC6.1 90.49,173.67 86.36,173.67 86.04,173.99 78.74,173.99 IC8.1 | 23A.1 69.85,196.22 v76.83,196.22
  Bottom 0.254: IC16.1 44.77,99.38 v44.77,100.65 | v66.36,102.23 66.67,102.55 66.67,140.65 v66.36,140.97 | IC7.1 86.36,127 86.36,136.84 v82.55,140.65 81.28,141.92 81.28,150.5 80.01,151.76 80.01,170.18 IC8.1 77.47,178.12 83.82,184.47 83.82,189.23 v76.83,196.22
/ROMCS'
  Bottom 0.254: IC4.22 120.02,159.38 120.02,174.94 121.92,176.85 R43.1 121.92,180.66 S4.3
/ROMOE  (via drill 0.51)
  Top 0.254: IC6.7 91.76,157.8 v95.57,157.8 | v96.2,177.8 96.52,178.12 105.73,178.12 106.05,178.44 113.67,178.44 R43.2
  Bottom 0.254: v95.57,157.8 95.25,158.12 95.25,168.59 94.93,168.91 94.93,169.54 96.2,170.81 v96.2,177.8
/WAIT  (via drill 0.51)
  Top 0.254: R23.1 52.07,129.54 62.87,129.54 63.5,130.18 | 63.5,130.18 63.82,130.49 69.53,130.49 IC1.24 | Q1.C 45.09,179.71 v53.66,179.71 65.72,179.71 v66.04,179.39 | v54.29,194.94 55.88,196.53 19A.1 | v63.18,130.18 63.5,130.18 | v65.09,147.64 65.72,148.27 v66.99,148.27
  Bottom 0.254: v53.66,179.71 54.29,180.34 v54.29,194.94 | v63.18,130.18 63.5,130.49 63.5,141.29 65.09,142.88 v65.09,147.64 | v66.99,148.27 67.94,149.22 67.94,164.15 68.9,165.1 71.75,165.1 71.75,166.69 70.8,167.64 66.04,167.64 v66.04,179.39
/WR  (via drill 0.51)
  Top 0.254: IC1.22 69.53,125.41 v61.28,125.41 | v60.96,91.76 62.55,90.17 72.39,90.17 IC17.4 | IC3.27 27.3,165.74 v45.4,165.74 | v49.85,194.94 50.8,195.9 17A.1 | v59.69,140.97 58.42,142.24 53.66,142.24 v50.8,145.1
  Bottom 0.254: v60.96,91.76 60.96,125.09 v61.28,125.41 60.96,125.73 60.96,139.7 v59.69,140.97 | v49.85,194.94 49.85,170.18 v45.4,165.74 48.58,162.56 48.58,147.32 v50.8,145.1
A0  (via drill 0.51)
  Top 0.254: v82.23,146.69 70.48,146.69 IC1.30 67.63,146.05 66.36,144.78 53.02,144.78 v52.7,145.1 | IC17.13 80.01,95.25 v70.8,95.25 | v136.84,177.48 135.25,179.07 116.52,179.07 115.57,180.02 v113.03,180.02 | v110.17,186.06 108.9,187.32 v87.63,187.32 | IC3.21 27.3,150.5 40.32,150.5 40.64,150.18 v49.53,150.18
  Bottom 0.254: IC3.21 23.5,154.31 23.5,194.63 25.4,196.53 7B.1 | v82.23,146.69 82.87,147.32 82.87,155.26 84.14,156.53 | IC8.10 84.14,156.53 | v70.8,95.25 70.8,111.12 71.12,111.44 71.12,115.57 67.31,119.38 67.31,143.19 69.85,145.73 IC1.30 | U3.5 136.84,174.31 v136.84,177.48 | v113.03,180.02 110.17,182.88 v110.17,186.06 | v87.63,187.32 82.55,182.25 82.55,158.12 84.14,156.53 | v49.53,150.18 52.7,147 v52.7,145.1
A0'  (via drill 0.51)
  Top 0.254: IC4.10 106.36,150.18 102.23,150.18 100.33,152.08 v86.04,152.08
  Bottom 0.254: v86.04,152.08 85.09,153.03 IC8.9
A1  (via drill 0.51)
  Top 0.254: IC3.23 32.7,156.21 33.66,155.26 42.23,155.26 42.55,155.57 49.85,155.57 50.48,154.94 55.56,154.94 61.28,149.22 69.22,149.22 IC1.31 73.98,148.59 v74.3,148.91 75.25,147.96 79.38,147.96 79.69,148.27 83.19,148.27 83.5,147.96 84.77,147.96 85.41,148.59 117.79,148.59 v118.11,148.91 | v74.61,157.16 IC8.6 | U3.1 125.09,175.9 120.33,175.9 v120.02,176.21 | v24.45,181.61 v27.94,185.1
  Bottom 0.254: v74.61,157.16 74.3,156.84 v74.3,148.91 | v27.94,185.1 8B.1 | v24.45,181.61 24.45,158.43 IC3.23 | v118.11,148.91 118.11,153.35 117.61,153.85 117.61,170.63 117.93,170.94 117.93,174.13 v120.02,176.21
A1'
  Top 0.254: IC4.9 108.58,154.31 108.58,156.21 78.74,156.21 IC8.7
A2  (via drill 0.51)
  Top 0.254: v81.6,151.45 70.17,151.45 IC1.32 68.26,151.13 v66.99,152.4 | v81.6,164.78 81.92,165.1 IC8.13 | v64.77,157.48 53.66,157.48 53.02,156.84 42.55,156.84 42.23,157.16 28.26,157.16 IC3.24 22.86,158.75 v22.54,159.07 | v22.54,189.23 v30.48,189.23
  Bottom 0.254: v81.6,164.78 v81.6,151.45 | v64.77,157.48 66.99,155.26 v66.99,152.4 | v30.48,189.23 9B.1 | v22.54,159.07 v22.54,189.23
A2'  (via drill 0.51)
  Top 0.254: IC4.8 104.78,153.03 v89.22,153.03
  Bottom 0.254: v89.22,153.03 87.63,154.62 87.63,160.02 IC8.12
A3  (via drill 0.51)
  Top 0.254: IC1.33 70.8,154.62 v73.34,154.62 | v73.66,167.32 73.98,167.64 IC8.3 | IC3.25 27.3,160.66 36.83,160.66 37.15,160.34 42.23,160.34 42.86,160.97 50.48,160.97 51.44,160.02 v73.66,160.02 | v33.34,189.23 33.66,189.55 44.13,189.55 44.77,190.18 72.39,190.18 v72.71,190.5
  Bottom 0.254: v73.34,154.62 73.66,154.94 v73.66,160.02 v73.66,167.32 73.66,189.55 v72.71,190.5 | 10B.1 33.34,199.71 v33.34,189.23
A3'  (via drill 0.51)
  Top 0.254: v104.46,162.24 102.87,163.83 78.74,163.83 IC8.4
  Bottom 0.254: IC4.7 104.46,159.7 v104.46,162.24
A4  (via drill 0.51)
  Top 0.254: IC7.10 94.93,110.81 v90.81,110.81 | v89.85,113.03 88.58,114.3 v63.18,114.3 | v59.69,155.89 60.01,156.21 IC1.34 | v30.8,173.04 31.11,173.35 v61.91,173.35
  Bottom 0.254: v90.81,110.81 89.85,111.76 v89.85,113.03 | v63.18,114.3 62.23,115.25 62.23,126.05 61.59,126.68 61.59,143.83 59.69,145.73 59.69,148.27 | v59.69,155.89 59.69,148.27 | IC3.26 30.8,167.96 v30.8,173.04 | 59.69,148.27 62.23,150.81 62.23,173.04 v61.91,173.35 61.59,173.67 61.59,188.28 62.55,189.23 62.55,195.58 63.5,196.53 22B.1
A4'  (via drill 0.51)
  Top 0.254: IC7.9 96.52,109.22 116.84,109.22 v118.43,110.81 | v111.76,134.94 v115.57,131.13
  Bottom 0.254: v118.43,110.81 118.11,111.12 118.11,120.33 116.2,122.24 116.2,125.41 115.57,126.05 v115.57,131.13 | v111.76,134.94 111.76,152.08 109.22,154.62 109.22,158.43 107.63,160.02 IC4.6
A5  (via drill 0.51)
  Top 0.254: v79.06,148.91 78.11,149.86 65.41,149.86 v61.28,153.99 | IC3.1 12.7,167.64 30.48,167.64 31.43,166.69 46.99,166.69 v47.31,166.37 | v60.64,182.25 v51.75,182.25 | v60.96,158.75 IC1.35
  Bottom 0.254: IC7.6 84.45,113.03 84.45,113.35 83.5,114.3 80.64,114.3 80.64,134.94 81.6,135.89 81.6,140.65 80.64,141.6 80.64,147.32 v79.06,148.91 | v61.28,153.99 60.96,154.31 v60.96,158.75 60.96,182.25 | 21B.1 60.96,182.25 | v47.31,166.37 51.12,170.18 51.12,173.35 51.75,173.99 v51.75,182.25 | 60.96,182.25 v60.64,182.25
A5'  (via drill 0.51)
  Top 0.254: v90.49,101.6 93.03,99.06 127.32,99.06 130.49,102.23 v145.41,102.23 | v149.54,151.76 143.83,157.48 141.29,157.48 138.43,160.34 138.43,163.51 123.19,163.51 122.87,163.83 109.22,163.83 107.95,162.56 IC4.5
  Bottom 0.254: IC7.7 90.49,107.63 v90.49,101.6 | v145.41,102.23 149.54,106.36 v149.54,151.76
A6  (via drill 0.51)
  Top 0.254: v35.56,194.94 11A.1 | v35.88,193.04 36.2,193.36 v57.15,193.36 | IC7.3 86.36,121.92 64.14,121.92 63.5,121.28 v57.15,121.28 | v57.47,133.03 57.15,133.35 IC1.16 | IC1.36 69.53,160.97 v58.1,160.97 | IC3.2 9.53,168.28 9.53,170.5 27.3,170.5 28.89,172.09 v42.55,172.09 | v45.72,175.26 55.24,175.26 v56.2,174.31
  Bottom 0.254: v35.56,194.94 35.88,194.63 v35.88,193.04 | 20B.1 58.1,199.71 58.1,194.31 v57.15,193.36 56.2,192.41 v56.2,174.31 58.1,172.4 v58.1,160.97 57.15,160.02 57.15,132.72 | 57.15,132.72 v57.15,121.28 | 57.15,132.72 v57.47,133.03 | v45.72,175.26 v42.55,172.09
A6'  (via drill 0.51)
  Top 0.254: IC7.4 88.9,119.38 v99.69,119.38 | v99.69,129.86 100.65,130.81 v111.44,130.81
  Bottom 0.254: v99.69,129.86 v99.69,119.38 | v111.44,130.81 112.71,132.08 112.71,160.34 107.95,165.1 IC4.4
A7  (via drill 0.51)
  Top 0.254: IC3.3 12.7,165.1 44.77,165.1 45.72,164.15 52.7,164.15 53.34,164.78 | 53.34,164.78 53.66,165.1 57.47,165.1 58.74,163.83 IC1.37 | v89.85,118.11 IC7.13 | v84.45,146.05 82.87,147.64 80.01,147.64 79.69,147.32 74.3,147.32 v73.98,147.64 | 53.34,164.78 v52.7,165.42
  Bottom 0.254: v89.85,118.11 89.53,118.43 89.53,128.27 87,130.81 87,143.51 v84.45,146.05 | v73.98,147.64 72.39,149.22 72.39,162.56 71.12,163.83 IC1.37 | 19B.1 55.88,195.9 55.24,195.26 55.24,174.62 52.7,172.09 v52.7,165.42
A7'  (via drill 0.51)
  Top 0.254: IC7.12 96.52,116.84 v102.87,116.84 | v105.73,127.64 107.95,129.86 v112.08,129.86
  Bottom 0.254: v102.87,116.84 105.73,119.7 v105.73,127.64 | v112.08,129.86 113.35,131.13 113.35,160.97 IC4.3
A8  (via drill 0.51)
  Top 0.254: IC3.4 12.7,162.56 37.15,162.56 37.78,163.19 v51.75,163.19 53.02,163.19 53.66,162.56 59.37,162.56 59.69,162.88 v65.72,162.88 | IC6.3 91.12,167.32 87,167.32 86.04,166.37 IC1.38
  Bottom 0.254: v65.72,162.88 69.22,166.37 IC1.38 | 18B.1 52.7,199.39 52.7,173.35 51.75,172.4 v51.75,163.19
A8'  (via drill 0.51)
  Top 0.254: v15.24,107.31 17.46,109.54 v18.73,109.54 | v18.73,172.09 19.68,173.04 v27.3,173.04 | v29.21,169.86 31.75,167.32 50.8,167.32 53.66,170.18 75.25,170.18 76.52,171.45 100.33,171.45 104.14,167.64 104.14,166.37 | 104.14,166.37 93.34,166.37 92.08,165.1 IC6.4 | IC4.25 108.9,165.1 107.63,166.37 104.14,166.37
  Bottom 0.254: D3.C 15.24,75.25 v15.24,107.31 | v18.73,109.54 19.68,110.49 19.68,137.16 18.73,138.11 v18.73,172.09 | v27.3,173.04 29.21,171.13 v29.21,169.86
A9  (via drill 0.51)
  Top 0.254: v10.79,78.42 24.45,78.42 28.89,73.98 D4.C | 7.94,158.75 v5.4,156.21 | IC3.5 7.94,158.75 | IC1.39 67.94,167 67.94,165.1 72.71,165.1 76.52,161.29 120.65,161.29 IC4.24 | v66.99,176.85 v50.8,176.85 | 7.94,158.75 7.94,170.5 7.62,170.81 7.62,172.72 18.1,172.72 19.68,174.31 v50.8,174.31
  Bottom 0.254: v10.79,78.42 6.35,82.87 6.35,126.68 5.4,127.64 v5.4,156.21 | 17B.1 v50.8,176.85 v50.8,174.31 | v66.99,176.85 67.94,175.9 67.94,170.81 IC1.39
A10  (via drill 0.51)
  Top 0.254: v4.76,79.38 31.11,79.38 35.56,74.93 40.64,74.93 41.59,73.98 D5.C | v4.45,150.81 9.84,156.21 IC3.6 | v118.43,154.94 IC4.21 | v118.73,166.85 118.11,166.85 116.05,168.91 105.73,168.91 v100.01,174.62 | v48.58,194.94 49.53,193.99 56.52,193.99 56.83,194.31 59.69,194.31 60.96,193.04 v69.85,193.04 | v14.92,176.53 15.24,176.21 v46.67,176.21
  Bottom 0.254: v4.76,79.38 4.13,80.01 4.13,114.3 2.86,115.57 2.86,149.22 v4.45,150.81 | v118.73,166.85 118.73,166.32 118.28,165.86 118.28,155.09 v118.43,154.94 | v100.01,174.62 100.33,174.94 100.33,187.32 93.98,193.68 93.98,197.17 93.03,198.12 82.55,198.12 81.6,199.07 69.85,199.07 v69.85,193.04 IC1.40 | 16B.1 48.58,199.71 v48.58,194.94 48.58,176.21 v46.67,176.21 | IC3.6 15.24,160.02 15.24,176.21 v14.92,176.53
A11  (via drill 0.51)
  Top 0.254: IC3.7 12.7,152.4 v55.88,152.4 | v123.51,166.69 124.14,167.32 124.14,175.26 112.08,175.26 109.54,177.8 106.36,177.8 105.73,177.16 96.84,177.16 95.57,175.9 65.72,175.9 | 65.72,175.9 61.28,171.45 IC1.1 | v47.31,177.16 48.58,175.9 65.72,175.9
  Bottom 0.254: 56.52,153.03 v55.88,152.4 | 56.52,153.03 56.52,169.54 IC1.1 | 56.52,153.03 56.52,122.87 54.61,120.97 54.61,73.98 D6.C | IC4.23 123.83,161.93 123.83,166.37 v123.51,166.69 | 15B.1 46.04,199.71 46.04,182.88 45.72,182.56 45.72,178.75 v47.31,177.16
A12  (via drill 0.51)
  Top 0.254: v66.04,145.73 65.09,146.69 61.91,146.69 58.74,149.86 v52.07,149.86 50.48,149.86 49.85,149.22 40.32,149.22 39.69,149.86 12.7,149.86 IC3.8 | v50.8,165.1 IC1.2 64.45,168.91 v64.77,169.23 | v103.19,185.42 102.23,186.37 71.75,186.37 v67.63,182.25 | v44.13,192.41 44.77,191.77 v63.5,191.77
  Bottom 0.254: v66.04,145.73 66.04,142.88 65.41,142.24 65.41,140.65 66.04,140.02 66.04,105.09 65.41,104.46 65.41,101.92 66.99,100.33 66.99,73.98 D7.C | v50.8,165.1 50.8,160.34 52.07,159.07 v52.07,149.86 | IC4.2 103.19,173.67 v103.19,185.42 | v64.77,169.23 64.77,179.39 v67.63,182.25 67.63,187.64 v63.5,191.77 | 14B.1 43.18,196.85 44.13,195.9 v44.13,192.41
A13  (via drill 0.51)
  Top 0.254: v61.28,75.25 73.03,75.25 73.34,74.93 78.74,74.93 79.69,73.98 D8.C | v59.05,164.78 57.47,166.37 IC1.3 | IC3.9 12.7,147.32 32.7,147.32 33.34,147.96 39.05,147.96 39.69,147.32 v46.67,147.32 v58.74,147.32
  Bottom 0.254: v61.28,75.25 60.96,75.56 60.96,90.49 60.01,91.44 60.01,102.55 60.33,102.87 60.33,139.06 58.74,140.65 v58.74,147.32 58.74,160.34 59.05,160.66 v59.05,164.78 | 13B.1 40.64,196.53 41.59,195.58 41.59,192.41 44.13,189.87 44.13,187.32 45.09,186.37 45.09,181.93 43.18,180.02 43.18,173.99 41.59,172.4 41.59,167.96 46.67,162.88 v46.67,147.32
A14  (via drill 0.51)
  Top 0.254: IC6.10 IC6.11 v93.66,160.02 | v52.7,161.93 52.39,162.24 v38.1,162.24 | v89.53,176.85 88.58,177.8 47.94,177.8 47.62,178.12 45.72,178.12 44.77,177.16 v38.1,177.16
  Bottom 0.254: v52.7,161.93 IC1.4 | 12B.1 v38.1,177.16 v38.1,162.24 | v93.66,160.02 93.34,160.34 93.34,173.04 v89.53,176.85
A14'  (via drill 0.51)
  Top 0.254: IC13.13 65.09,93.66 v69.85,93.66 | v97.47,124.78 97.79,124.46 104.46,124.46 v107.31,121.6
  Bottom 0.254: 107.31,79.38 109.86,79.38 109.86,81.92 IC12.9 | 107.31,79.38 98.11,79.38 92.71,73.98 D9.C 92.39,73.98 92.39,72.71 78.11,72.71 71.12,79.69 71.12,92.39 v69.85,93.66 | IC6.9 98.42,154.31 98.42,152.08 97.47,151.13 v97.47,124.78 | 107.31,79.38 v107.31,121.6
A15  (via drill 0.51)
  Top 0.254: v37.47,161.29 38.42,161.29 38.73,161.61 50.8,161.61 51.44,160.97 54.29,160.97 IC1.5 55.24,161.93 v60.01,161.93 | IC23.4 115.57,118.11 v115.89,118.11 | v114.3,151.45 114.3,151.76 112.39,153.67 v111.76,153.67 | v107.95,163.83 103.82,163.83 102.55,165.1 IC6.13 | v60.01,178.75 60.33,178.44 83.82,178.44 v84.14,178.75 | v87.95,166.37 92.39,166.37 93.66,167.64 IC6.14
  Bottom 0.254: v37.47,161.29 36.83,161.93 36.83,195.26 35.56,196.53 11B.1 | IC6.14 IC6.13 | v115.89,118.11 115.57,118.43 115.57,125.09 114.3,126.36 v114.3,151.45 | v111.76,153.67 111.76,160.02 v107.95,163.83 | v60.01,161.93 60.33,162.24 60.33,178.44 v60.01,178.75 | v84.14,178.75 87.95,174.94 v87.95,166.37
A15'  (via drill 0.51)
  Top 0.254: v50.48,77.79 50.8,78.11 64.45,78.11 65.72,76.83 v72.71,76.83 | v98.74,174.62 99.69,175.58 106.05,175.58 111.76,169.86 v114.62,169.86 | v115.57,152.72 119.54,148.74 v150.37,148.74 | D10.C 120.02,73.98 123.51,77.47 150.5,77.47 152.08,79.06 152.08,80.64 148.59,80.64 v148.27,80.33
  Bottom 0.254: IC16.4 47.62,83.19 47.62,80.64 v50.48,77.79 | v72.71,76.83 77.47,72.07 104.78,72.07 104.78,73.98 D10.C | IC6.12 97.16,164.47 97.16,173.04 v98.74,174.62 | v114.62,169.86 115.57,168.91 v115.57,152.72 | v150.37,148.74 150.18,148.55 150.18,82.23 v148.27,80.33
CPUCLK  (via drill 0.51)
  Top 0.254: IC1.6 R20.1 49.53,157.48 42.86,157.48 41.91,158.43 29.53,158.43 27.94,160.02 14.92,160.02 12.38,157.48 v7.94,157.48 | v12.38,112.39 14.29,110.49 20,110.49 22.54,107.95 26.35,107.95 v28.26,106.05
  Bottom 0.254: IC15.10 32.38,88.27 32.38,89.53 33.66,90.81 | v7.94,157.48 6.99,156.53 6.99,127.95 12.7,122.24 12.7,112.71 v12.38,112.39 | v28.26,106.05 27.94,105.73 27.94,97.47 31.11,94.3 31.11,93.34 33.66,90.81 | 33.66,90.81 IC15.12
D0  (via drill 0.51)
  Top 0.254: IC1.14 R4.2 | v8.89,110.17 13.02,114.3 IC10.7 16.51,113.03 28.26,113.03 30.8,115.57 32.7,115.57 33.34,116.2 38.73,116.2 IC9.11 40.01,116.84 v43.18,120.02
  Bottom 0.254: IC14.4 8.89,91.44 v8.89,110.17 | R4.2 47.94,135.57 47.94,124.78 v43.18,120.02
D0'  (via drill 0.51)
  Top 0.254: IC3.11 15.24,139.7 33.34,139.7 33.66,139.38 35.24,139.38 35.56,139.06 37.47,139.06 38.1,139.7 40.96,139.7 41.59,139.06 42.55,139.06 R4.1 44.45,138.43 45.72,137.16 57.78,137.16 | v59.37,115.57 IC5.7 | 57.78,137.16 v59.37,135.57 | IC4.11 106.36,147 102.23,147 101.28,146.05 85.72,146.05 83.5,143.83 v79.06,143.83 | v76.52,137.48 76.2,137.16 57.78,137.16 | v17.78,194.31 4A.1
  Bottom 0.254: v59.37,115.57 59.69,115.89 59.69,135.25 v59.37,135.57 | v79.06,143.83 76.52,141.29 v76.52,137.48 | v17.78,194.31 16.83,193.36 16.83,148.91 IC3.11
D1  (via drill 0.51)
  Top 0.254: R5.2 51.44,135.89 IC1.15 | IC14.2 12.7,95.25 v21.59,95.25 | v26.35,117.79 27.94,117.79 30.8,120.65 32.7,120.65 33.97,119.38 IC9.12 40.96,120.97 v52.39,120.97
  Bottom 0.254: v21.59,95.25 21.59,110.49 IC10.9 22.86,112.08 24.77,113.98 24.77,116.2 v26.35,117.79 | R5.2 50.8,132.4 52.07,131.13 52.07,127.95 51.75,127.64 51.75,125.09 52.07,124.78 52.07,121.28 v52.39,120.97
D1'  (via drill 0.51)
  Top 0.254: v17.78,193.04 20.32,195.58 5A.1 | R5.1 49.21,135.25 50.48,133.99 51.44,133.99 v51.75,134.3 | v52.7,127.32 53.02,127 56.52,127 v58.1,125.41 | v57.78,117.79 59.05,116.52 63.5,116.52 63.82,116.2 73.34,116.2 73.98,116.84 81.28,116.84 IC5.14 | v90.17,128.91 v100.65,128.91 | IC3.12 9.53,142.88 9.53,154.94 v25.4,154.94 | v29.84,159.38 30.16,159.7 42.55,159.7 42.86,160.02 v47.62,160.02
  Bottom 0.254: IC3.12 17.78,147.32 v17.78,193.04 | 52.07,133.99 52.7,133.35 v52.7,127.32 | v58.1,125.41 58.1,120.02 57.78,119.7 v57.78,117.79 | IC4.12 104.78,142.88 104.78,133.03 v100.65,128.91 | v90.17,128.91 90.49,128.59 90.49,118.75 90.81,118.43 90.81,116.52 88.58,114.3 84.45,114.3 83.19,115.57 IC5.14 | v25.4,154.94 29.21,154.94 29.21,158.75 v29.84,159.38 | v47.62,160.02 47.94,159.7 47.94,142.88 52.07,138.75 52.07,133.99 | 52.07,133.99 v51.75,134.3
D2  (via drill 0.51)
  Top 0.254: IC14.10 20.32,87.63 v36.83,87.63 | v36.51,120.33 38.1,121.92 IC9.13 41.91,121.92 v42.55,122.56 | IC10.11 29.53,116.84 30.8,118.11 v36.51,118.11 | R6.2 49.21,141.92 v47.62,141.92
  Bottom 0.254: IC1.12 R6.2 | v36.83,87.63 36.51,87.95 v36.51,118.11 v36.51,120.33 | v47.62,141.92 46.35,140.65 46.35,126.36 v42.55,122.56
D2'  (via drill 0.51)
  Top 0.254: IC3.13 12.7,137.16 19.68,137.16 | 19.68,137.16 36.2,137.16 36.51,137.48 40.01,137.48 40.32,137.16 43.81,137.16 v44.13,137.48 | v81.6,133.99 80.96,134.62 53.34,134.62 52.07,133.35 45.72,133.35 v44.77,134.3 | IC4.13 106.36,141.92 v103.82,141.92 | v85.09,131.76 v102.23,131.76 | 6A.1 22.86,192.72 v22.54,192.72 | 19.68,137.16 v19.68,138.43
  Bottom 0.254: 44.45,137.79 44.45,141.29 43.18,142.56 R6.1 | IC5.17 84.45,125.09 84.45,131.13 | v81.6,133.99 84.45,131.13 | v44.77,134.3 44.45,134.62 44.45,137.79 | 44.45,137.79 v44.13,137.48 | v103.82,141.92 102.23,140.34 v102.23,131.76 | 84.45,131.13 v85.09,131.76 | v22.54,192.72 19.68,189.87 v19.68,138.43
D3  (via drill 0.51)
  Top 0.254: IC1.8 R7.2 49.53,154.94 42.86,154.94 42.23,154.31 v29.84,154.31 | v10.48,118.75 11.11,119.38 IC10.5 19.05,123.19 20.95,123.19 | IC9.14 38.73,125.09 35.88,125.09 35.24,125.73 29.53,125.73 26.99,123.19 20.95,123.19 | 20.95,123.19 v20.95,125.09
  Bottom 0.254: IC14.6 7.94,87.31 7.94,116.2 v10.48,118.75 | v29.84,154.31 28.57,153.03 28.57,148.27 27.62,147.32 20.95,147.32 v20.95,125.09
D3'  (via drill 0.51)
  Top 0.254: IC5.18 84.14,127.32 85.72,127.32 86.36,127.95 v94.3,127.95 | IC4.15 120.65,138.43 94.61,138.43 v94.3,138.11 93.98,138.43 78.74,138.43 77.47,139.7 65.09,139.7 64.45,139.06 56.2,139.06 55.56,139.7 47.31,139.7 v44.45,142.56 | v30.48,153.35 30.8,153.67 R7.1 | 9A.1 30.48,193.04 v31.43,193.04
  Bottom 0.254: v94.3,127.95 94.61,128.27 94.61,137.79 v94.3,138.11 | IC3.15 24.77,137.79 24.77,143.83 25.72,144.78 30.48,144.78 v30.48,153.35 30.8,153.67 30.8,155.89 31.75,156.84 31.75,192.72 v31.43,193.04 | v44.45,142.56 44.45,152.4 R7.1
D4  (via drill 0.51)
  Top 0.254: IC1.7 v41.91,156.21 | IC10.13 29.21,121.92 IC9.3 34.61,124.46 v34.92,124.78 | R8.2 40.32,138.11 v34.92,138.11
  Bottom 0.254: R8.2 40.96,138.75 40.96,140.34 41.59,140.97 41.59,141.6 41.27,141.92 41.27,150.18 41.91,150.81 v41.91,156.21 | IC14.8 20.95,83.19 20.95,94.61 20.64,94.93 20.64,95.89 20.95,96.2 20.95,120.02 IC10.13 | v34.92,124.78 v34.92,138.11
D4'  (via drill 0.51)
  Top 0.254: v76.83,135.57 78.42,137.16 90.49,137.16 91.76,135.89 104.14,135.89 106.05,137.79 122.24,137.79 123.83,139.38 123.83,142.24 IC4.16 | R8.1 IC3.16 | v33.97,140.34 34.29,140.02 v35.88,140.02 36.2,139.7 37.15,139.7 37.78,140.34 41.59,140.34 v41.91,140.02 | v34.29,194.94 33.02,196.22 10A.1 | IC5.3 73.66,127 v65.09,127 | v65.09,132.08 52.07,132.08 51.44,132.72 v43.81,132.72
  Bottom 0.254: IC5.3 76.83,127.64 v76.83,135.57 | R8.1 33.97,139.38 v33.97,140.34 | v35.88,140.02 35.56,140.34 35.56,143.83 36.51,144.78 38.1,144.78 38.1,159.38 36.2,161.29 36.2,191.45 34.29,193.36 v34.29,194.94 | v65.09,132.08 v65.09,127 | v43.81,132.72 41.91,134.62 v41.91,140.02
D5  (via drill 0.51)
  Top 0.254: v17.78,119.06 19.37,120.65 29.84,120.65 31.11,121.92 IC9.4 | v36.83,136.53 36.2,135.89 v33.97,135.89 | v40.96,151.13 IC1.9 | v40.64,141.29 40.32,140.97 R9.2
  Bottom 0.254: IC14.12 17.14,93.34 17.14,98.11 17.78,98.74 v17.78,119.06 | v36.83,136.53 R9.2 | v33.97,135.89 33.66,135.57 33.66,123.83 IC9.4 | v40.96,151.13 40.64,150.81 v40.64,141.29
D5'  (via drill 0.51)
  Top 0.254: IC3.17 R9.1 30.48,140.97 30.48,143.51 v31.43,144.46 | 73.66,124.46 IC5.4 | 73.66,124.46 41.91,124.46 40.64,125.73 36.2,125.73 33.66,128.27 v28.89,128.27 | IC4.17 120.02,142.88 v109.54,142.88 | v109.22,128.59 107.31,126.68 96.52,126.68 96.2,127 86.36,127 83.82,124.46 73.66,124.46 | 8A.1 27.94,193.04 v28.89,193.04 | v32.7,182.88 v30.8,184.78
  Bottom 0.254: v28.89,128.27 29.21,128.59 R9.1 | v109.54,142.88 109.22,142.88 v109.22,128.59 | v28.89,193.04 29.53,192.41 29.53,186.06 v30.8,184.78 | v32.7,182.88 32.38,182.56 32.38,156.53 31.43,155.57 v31.43,144.46
D6  (via drill 0.51)
  Top 0.254: v31.75,143.19 36.51,143.19 R10.2 38.1,143.51 v39.69,145.1 | v39.69,148.59 IC1.10
  Bottom 0.254: IC15.6 24.13,86.36 24.13,103.19 29.84,108.9 29.84,117.47 | IC9.5 29.84,117.47 | 29.84,117.47 29.84,129.86 31.11,131.13 31.11,133.03 D11.A v31.75,143.19 | v39.69,145.1 v39.69,148.59
D6'  (via drill 0.51)
  Top 0.254: R28.1 54.61,86.36 IC13.5 | IC3.18 R10.1 31.11,145.41 v34.29,145.41 | IC4.18 120.65,146.05 v102.87,146.05 | v102.3,182.84 101.3,183.83 v80.33,183.83 | v76.83,180.34 76.52,180.66 45.09,180.66 44.77,180.97 35.24,180.97 33.34,179.07 | 33.34,179.07 33.02,178.75 v26.67,178.75 | v26.35,194.94 25.4,195.9 7A.1 | 33.34,179.07 v34.61,177.8 | v42.23,129.86 40.64,131.44 40.64,133.35 33.66,133.35 32.7,132.4 30.48,132.4 v30.16,132.72
  Bottom 0.254: v102.87,146.05 102.3,146.62 v102.3,182.84 | v76.83,180.34 v80.33,183.83 | v26.67,178.75 26.04,179.39 26.04,185.42 26.35,185.74 v26.35,194.94 | v34.29,145.41 34.61,145.73 v34.61,177.8 | R28.1 45.72,87.63 45.72,105.41 41.59,109.54 41.59,122.87 42.23,123.51 42.23,127.64 41.91,127.95 41.91,129.54 v42.23,129.86 | v30.16,132.72 29.84,133.03 29.84,140.02 30.48,140.65 30.48,142.24 R10.1
D7  (via drill 0.51)
  Top 0.254: R11.2 42.23,146.05 47.31,140.97 IC1.13 | v32.07,94.3 IC15.4 | IC10.3 13.97,123.19 11.11,123.19 9.53,121.6 9.53,117.79 13.97,117.79 14.29,118.11 19.37,118.11 21.91,115.57 29.84,115.57 31.11,116.84 IC9.6
  Bottom 0.254: v32.07,94.3 32.38,94.61 32.38,98.11 33.02,98.74 33.02,110.81 33.66,111.44 33.66,114.94 IC9.6 31.75,117.16 35.88,121.28 35.88,125.09 35.56,125.41 35.56,132.4 35.88,132.72 35.88,138.75 34.92,139.7 34.92,144.15 R11.2
D7'  (via drill 0.51)
  Top 0.254: IC3.19 R11.1 32.7,146.05 v33.66,147 | IC5.13 81.92,112.39 76.52,112.39 75.88,111.76 71.44,111.76 70.17,110.49 59.37,110.49 54.93,106.05 36.51,106.05 34.29,108.27 v27.94,108.27 | IC4.19 119.02,152.76 116.74,152.76 114.48,155.02 v114.14,155.02 | v105.09,179.07 104.78,178.75 85.41,178.75 82.87,181.29 45.4,181.29 45.09,181.61 34.61,181.61 v33.97,180.97 | 1A.1 3.49,193.36 3.49,186.37 26.67,186.37 26.99,186.69 v32.7,186.69
  Bottom 0.254: v27.94,108.27 27.94,110.17 28.57,110.81 28.57,125.41 27.3,126.68 27.3,133.03 24.13,136.21 24.13,144.15 26.04,146.05 IC3.19 | v114.14,155.02 113.98,155.18 113.98,167.64 105.09,176.53 v105.09,179.07 | v33.66,147 33.66,180.66 v33.97,180.97 34.29,181.29 34.29,185.1 v32.7,186.69
GND  (via drill 0.51)
  Top 0.5: IC4.20 123.19,152.4 C16.2 138.43,149.86 U1.7 146.05,149.86 v146.69,149.86 | S3.1 110.17,189.87 112.39,189.87 R34.2 113.03,189.55 115.57,192.09 120.65,192.09 J1.3 | X2.1 134.3,202.56 120.65,202.56 X4.1 120.33,202.25 119.38,201.29 84.77,201.29 80.64,197.17 X5.1 | IC6.15 98.74,170.5 v94.61,170.5 | IC21.10 IC4.14 | IC1.29 74.93,143.51 C10.- | C24.2 59.05,153.03 59.05,154.94 66.04,154.94 68.58,152.4 75.25,152.4 75.56,152.08 76.83,152.08 77.47,152.72 77.47,153.67 | IC8.8 77.47,153.67 | IC6.8 90.49,153.99 86.68,153.99 86.36,153.67 77.47,153.67 | IC21.14 100.01,150.18 v94.93,150.18 | C20.2 122.56,129.54 U2.7 126.36,129.54 C17.2 | IC5.10 76.2,109.22 86.36,109.22 IC7.8 88.9,106.68 v98.74,106.68 102.55,106.68 102.71,106.84 | 102.71,106.84 102.87,106.68 111.76,106.68 IC23.7 118.11,107.95 IC23.9 124.46,110.49 U5.7 129.22,105.73 v129.86,105.73 | 102.71,106.84 IC19.7 | IC20.7 134.62,82.55 C15.1 | 103.03,80.17 102.87,80.01 91.44,80.01 IC11.7 86.36,81.28 85.09,80.01 74.93,80.01 IC17.7 73.66,80.96 72.07,79.38 58.74,79.38 57.15,80.96 IC13.7 55.88,80.01 44.77,80.01 43.5,81.28 IC16.7 41.27,81.92 36.2,81.92 35.56,82.55 25.72,82.55 25.56,82.39 | 103.03,80.17 IC12.7 | 103.03,80.17 103.19,80.01 117.79,80.01 IC18.7 118.75,80.64 | C26.2 IC20.1 133.35,96.84 136.21,96.84 137.32,97.95 | 137.32,97.95 C6.2 | 137.32,97.95 137.48,97.79 ZX81LED.K 146.69,97.79 146.69,93.34 151.13,88.9 XTAL.2 | 25.56,82.39 25.4,82.55 12.7,82.55 IC14.7 4.13,88.58 2.22,88.58 v2.22,86.36 | 25.56,82.39 IC15.7 | 16.51,101.28 16.51,100.33 15.24,100.33 C3.2 | 16.51,101.28 POWERLED.K | C8.- v18.73,189.23 | R25.1 IC9.10 38.73,113.67 33.66,113.67 IC9.8
  Top 0.5: C1.2 36.51,131.76 23.18,131.76 R1.1 19.05,135.89 IC3.14 3.49,135.89 3.49,166.37 | 3.49,179.39 4.76,180.66 10.48,180.66 IC22.2 1.59,181.61 | 3.49,166.37 3.49,179.39 | 16.51,101.28 29.53,101.28 C2.2 | 3.49,179.39 1.91,180.97 v1.91,188.59 | 3.49,166.37 4.45,165.42 v4.45,165.1 | U4.7 140.65,129.54 v144.15,126.05 | v147,147.32 142.24,147.32 v141.92,147 | SW2.5 SW2.4
  Bottom 0.5: U3.7 144.78,173.99 144.78,174.31 145.57,175.1 | 145.57,175.1 145.73,175.26 147.32,175.26 147.32,179.07 C18.2 | U3.7 140.97,172.72 140.97,154.94 U1.7 | C13.2 121.28,187.32 121.28,191.13 120.65,191.77 J1.3 120.65,192.09 118.43,194.31 118.43,200.34 120.33,202.25 X4.1 | C19.2 109.22,189.23 109.86,189.87 S3.1 109.54,189.87 103.5,189.87 S3.2 | X3.2 152.72,194.31 152.72,198.12 148.59,202.25 X3.1 148.27,202.25 134.94,202.25 X2.1 134.62,202.25 138.11,198.75 138.11,194.94 138.75,194.31 X2.2 139.06,193.99 139.06,193.36 143.51,188.91 143.51,177.16 145.57,175.1 | IC8.15 87,168.28 87,165.74 88.11,164.62 | 88.11,164.62 90.17,162.56 IC6.5 | 85.72,188.28 81.92,192.09 81.92,195.58 80.64,196.85 X5.1 | 88.11,164.62 88.9,165.42 88.9,175.9 | 98.42,123.19 IC7.15 | 98.42,123.19 98.42,137.79 98.58,137.95 | IC21.10 98.58,137.95 | IC21.14 98.42,147.96 98.42,138.11 98.58,137.95 | IC5.1 75.56,131.44 C4.2 75.56,144.15 C10.- 77.47,146.05 IC8.8 | 94.46,150.65 91.44,153.67 IC6.8 | 94.46,150.65 v94.93,150.18 | 94.46,150.65 94.61,150.81 94.61,160.66 94.3,160.97 94.3,170.5 v94.61,170.5 93.98,171.13 93.98,173.99 93.98,174.62 SW2.4 | R45.1 74.93,103.82 IC5.10 | IC23.9 IC23.10 118.75,114.94 118.75,118.44 119.84,119.54 121.77,119.54 122.61,120.38 122.61,124.14 120.39,126.36 C20.2 | IC23.7 115.57,105.41 C27.2 115.57,96.84 IC18.2 118.43,93.66 114.62,89.85 114.62,88.58 116.84,86.36 116.84,82.87 IC18.7 | C5.2 153.35,86.36 151.13,88.58 XTAL.2 | C6.2 138.75,99.38 138.75,107 U6.7 141.6,109.86 141.6,111.76 138.43,111.76 137.79,112.39 137.79,128.91 U4.7 | C15.1 144.15,82.87 144.15,95.89 ZX81LED.K
  Bottom 0.5: POWERLED.K 16.19,105.73 16.19,108.27 R2.1 IC10.8 | IC14.7 13.97,81.28 C3.2 | 18.73,195.58 17.78,196.53 4B.1 | 18.73,195.58 18.73,195.9 20.32,195.9 5B.1 | C23.- 9.21,177.48 9.21,179.71 11.11,181.61 IC22.2 11.75,181.61 13.65,183.51 13.65,188.91 C8.- | v18.73,189.23 18.73,195.58 | IC9.8 C2.2 | 37.62,128.75 36.83,129.54 C1.2 | 37.62,128.75 IC9.15 | IC9.10 37.47,116.2 37.47,128.59 37.62,128.75 | 98.42,123.19 98.74,122.87 v98.74,106.68 | v2.22,86.36 2.22,84.77 | v1.91,188.59 1.59,188.59 1.59,188.91 | v4.45,165.1 4.45,165.42 | U3.7 144.46,171.77 v144.46,170.5 143.83,169.86 v141.6,169.86 | v146.69,149.86 146.69,147.32 v147,147.32 | v141.92,147 141.92,145.1 141.29,144.46 v141.29,142.88 | v144.15,126.05 144.15,119.06 v143.83,119.06 | C26.2 v129.86,105.73
  pour Bottom (isolate 0.406): 0.32,204.15 155.26,204.15 155.26,68.58 0,68.58 0,204.15
  pour Top (isolate 0.406): 0,204.15 155.26,204.15 155.26,68.58 0,68.58
HSYNC  (via drill 0.51)
  Top 0.254: U2.8 133.67,129.22 136.53,129.22 140.34,125.41 v141.92,125.41
  Bottom 0.254: U6.5 141.92,115.25 v141.92,125.41 141.92,137.79 144.46,140.34 144.46,140.65 U4.13
IC5_PIN9  (via drill 0.51)
  Top 0.254: IC13.11 65.09,89.22 v67.94,89.22 | v67.94,108.27 69.53,109.86 74.3,109.86 IC5.9 75.56,110.49 76.83,111.76 146.05,111.76 U6.9
  Bottom 0.254: v67.94,108.27 v67.94,89.22
IC11_PIN11  (via drill 0.51)